# Altium schematic sheet 毕设原理图.SchDoc
size A4
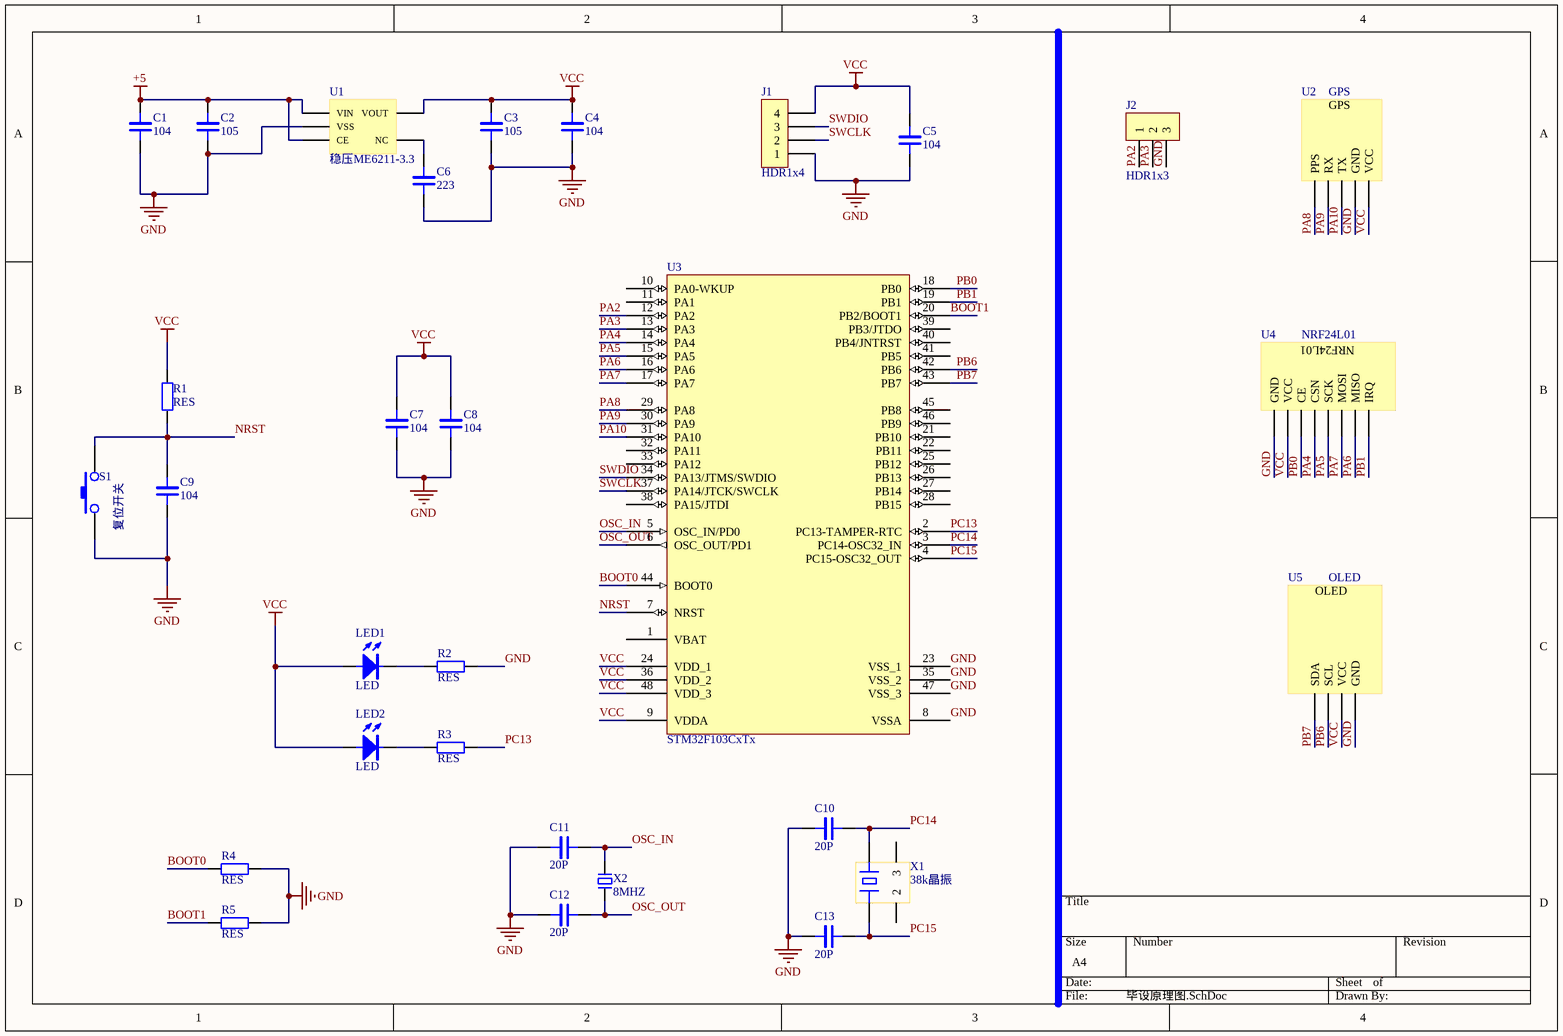
[diagram p0: 毕设原理图.SchDoc]

## Parts
C1  104  [0805]
C2  105  [0805]
C3  105  [0805]
C4  104  [0805]
C5  104  [0805]
C6  223  [0805]
C7  104  [0805]
C8  104  [0805]
C9  104  [0805]
C10  20P  [0805]
C11  20P  [0805]
C12  20P  [0805]
C13  20P  [0805]
J1  HDR1x4  [PIN-4-2.54-1.0]
J2  HDR1x3  [PIN-3-2.54-1.0]
LED1  LED  [LED-0805]
LED2  LED  [LED-0805]
R1  RES  [0805]
R2  RES  [0805]
R3  RES  [0805]
R4  RES  [0805]
R5  RES  [0805]
S1  复位开关  [按键开关]
U1  稳压ME6211-3.3  [稳压ME6211-3.3]
U2  GPS  [GPS]
U3  STM32F103CxTx  [QFP-48-0.5]
U4  NRF24L01  [NRF24L01]
U5  OLED  [OLED]
X1  38k晶振  [38k晶振]
X2  8MHZ  [晶振1]

## Nets
+5: C1.1 C2.1 U1.1(VIN) U1.3(CE)
GND: C1.2 C2.2 C3.2 C4.2 C5.2 C6.2 C7.2 C8.2 C9.2 C10.1 C11.1 C12.1 C13.1 J1.1 J2.3 R2.1 R4.1 R5.1 S1.1 U1.2(VSS) U2.4(GND) U3.8(VSSA) U3.23(VSS_1) U3.35(VSS_2) U3.47(VSS_3) U4.1(GND) U5.4(GND)
VCC: C3.1 C4.1 C5.1 C7.1 C8.1 J1.4 LED1.1(A) LED2.1(A) R1.2 U1.5(VOUT) U2.5(VCC) U3.9(VDDA) U3.24(VDD_1) U3.36(VDD_2) U3.48(VDD_3) U4.2(VCC) U5.3(VCC)
BOOT0: R4.2 U3.44(BOOT0)
BOOT1: R5.2 U3.20(PB2/BOOT1)
NRST: C9.1 R1.1 S1.2 U3.7(NRST)
OSC_IN: C11.2 U3.5(OSC_IN/PD0) X2.2
OSC_OUT: C12.2 U3.6(OSC_OUT/PD1) X2.1
PA2: J2.1 U3.12(PA2)
PA3: J2.2 U3.13(PA3)
PA4: U3.14(PA4) U4.4(CSN)
PA5: U3.15(PA5) U4.5(SCK)
PA6: U3.16(PA6) U4.7(MISO)
PA7: U3.17(PA7) U4.6(MOSI)
PA8: U2.1(PPS) U3.29(PA8)
PA9: U2.2(RX) U3.30(PA9)
PA10: U2.3(TX) U3.31(PA10)
PB0: U3.18(PB0) U4.3(CE)
PB1: U3.19(PB1) U4.8(IRQ)
PB6: U3.42(PB6) U5.2(SCL)
PB7: U3.43(PB7) U5.1(SDA)
PC13: R3.1 U3.2(PC13-TAMPER-RTC)
PC14: C10.2 U3.3(PC14-OSC32_IN) X1.4
PC15: C13.2 U3.4(PC15-OSC32_OUT) X1.1
SWCLK: J1.2 U3.37(PA14/JTCK/SWCLK)
SWDIO: J1.3 U3.34(PA13/JTMS/SWDIO)
NetC6_1: C6.1 U1.4(NC)
NetLED1_2: LED1.2(C) R2.2
NetLED2_2: LED2.2(C) R3.2

Not connected (* = marked no-connect by the designer): U3 1(VBAT) 10(PA0-WKUP) 11(PA1) 21(PB10) 22(PB11) 25(PB12) 26(PB13) 27(PB14) 28(PB15) 32(PA11) 33(PA12) 38(PA15/JTDI) 39(PB3/JTDO) 40(PB4/JNTRST) 41(PB5) 45(PB8) 46(PB9); X1 2 3

## Library data of the parts
C1-C13 = CAP: Capacitor
J1 = HDR1x4: Connector
J2 = HDR1x3: Connector
R1-R5 = RES: Resistor
S1 = 按键开关
U3 = STM32F103CxTx: MCU
X2 = 晶振1（单片机）